# Altium schematic sheet RPE_Sch.SchDoc
size A4; SheetNumber: 1; SheetTotal: 2
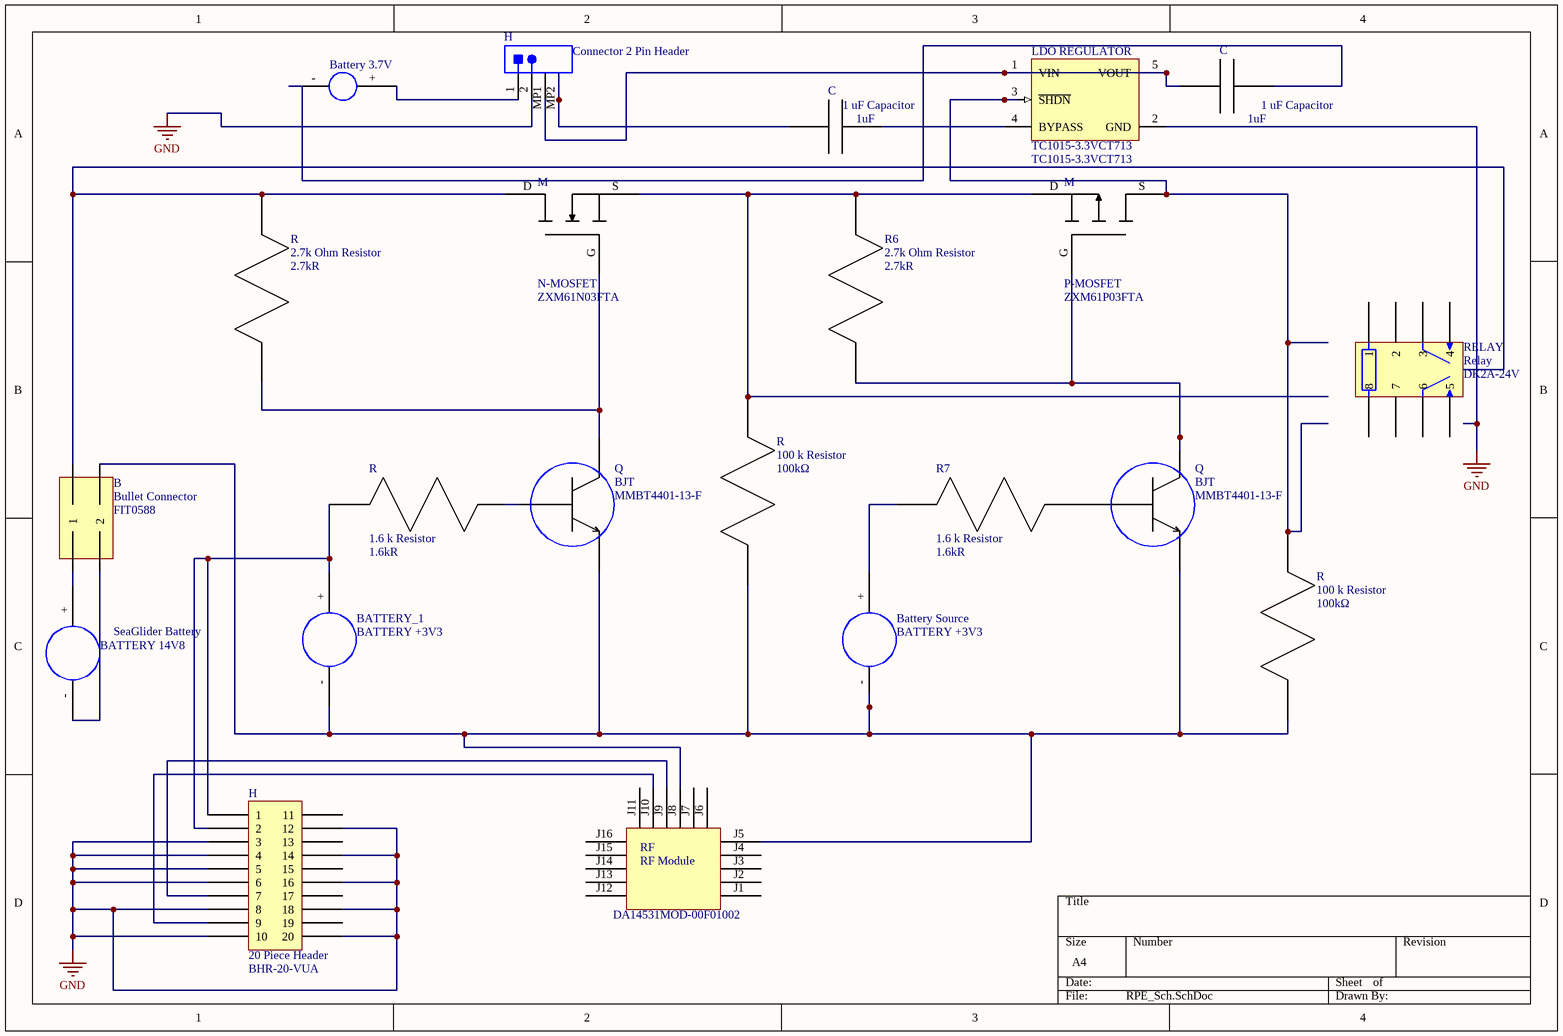
[diagram p0: RPE_Sch.SchDoc]

## Parts
(Parts that share a designator on the sheet are numbered #1, #2 ... from top to bottom, then left to right.)
B  Bullet Connector
BATTERY_1  BATTERY +3V3
Battery_3.7V  (no value)
Battery_Source  BATTERY +3V3
C#1  1 uF Capacitor  value 1uF
C#2  1 uF Capacitor  value 1uF
H#1  Connector 2 Pin Header
H#2  20 Piece Header
LDO_REGULATOR  TC1015-3.3VCT713
M#1  N-MOSFET
M#2  P-MOSFET
Q#1  BJT  Manufacturer Part Number: MMBT4401-13-F
Q#2  BJT  Manufacturer Part Number: MMBT4401-13-F
R6  2.7k Ohm Resistor  value 2.7kR
R7  1.6 k Resistor  value 1.6kR
R#1  2.7k Ohm Resistor  value 2.7kR
R#2  100 k Resistor  Resistance: 100kΩ
R#3  1.6 k Resistor  value 1.6kR
R#4  100 k Resistor  Resistance: 100kΩ
RELAY  Relay
RF  RF Module
SeaGlider_Battery  BATTERY 14V8

## Nets
GND: H#1.2 H#2.?2(12) H#2.?4(14) H#2.?6(16) H#2.?8(18) H#2.?10(20) H#2.?13(3) H#2.?14(4) H#2.?15(5) H#2.?16(6) H#2.?18(8) H#2.?20(10) LDO_REGULATOR.2(GND)
NetB_?1: B.?1 M#1.D R#1.?1
NetB_?2: B.?2 BATTERY_1.- Battery_Source.- Q#1.?2 Q#2.?2 R#2.?2 R#4.?2 RF.J5 RF.J8
NetB_?3: B.?3(2) SeaGlider_Battery.-
NetB_?4: B.?4(1) SeaGlider_Battery.+
NetBATTERY_1_+: BATTERY_1.+ H#2.?11(1) H#2.?12(2) R#3.?2
NetBattery_3.7V_+: Battery_3.7V.+ H#1.1
NetBattery_3.7V_-: Battery_3.7V.- C#1.?1
NetBattery_Source_+: Battery_Source.+ R7.?2
NetC#1_?2: C#1.?2 H#1.MP1 LDO_REGULATOR.1(VIN) LDO_REGULATOR.5(VOUT)
NetC#2_?1: C#2.?1 LDO_REGULATOR.4(BYPASS)
NetC#2_?2: C#2.?2 H#1.MP2
NetH#2_?17: H#2.?17(7) RF.J9
NetH#2_?19: H#2.?19(9) RF.J10
NetLDO_REGULATOR_3: LDO_REGULATOR.3(~{SHDN}) M#2.S R#4.?1
NetM#1_G: M#1.G Q#1.?1 R#1.?2
NetM#1_S: M#1.S M#2.D R6.?1 R#2.?1
NetM#2_G: M#2.G Q#2.?1 R6.?2
NetQ#1_?3: Q#1.?3 R#3.?1
NetQ#2_?3: Q#2.?3 R7.?1

Not connected (* = marked no-connect by the designer): H#2 ?1(11) ?3(13) ?5(15) ?7(17) ?9(19); RELAY ?1(5) ?2(3) ?3(2) ?4(1) ?5(6) ?6(4) ?7(7) ?8(8); RF J1 J2 J3 J4 J6 J7 J11 J12 J13 J14 J15 J16

## Library data of the parts
B = FIT0588: High Quality Gold Plated Male and Female Bullet Connector; Manufacturer: DFRobot; Supplier: Digi-Key; Supplier Part Number: 1738-1438-ND; RoHS: No; Category: Uncategorized; Stock: 164; Pricing: 1=3.9 (USD); ComponentLink1URL: https://media.digikey.com/pdf/Data%20Sheets/DFRobot%20PDFs/FIT0588_Web.pdf?src-supplier=Digi-Key; ComponentLink1Description: https://media.digikey.com/pdf/Data%20Sheets/DFRobot%20PDFs/FIT0588_Web.pdf?src-supplier=Digi-Key; Manufacturer Part Number: FIT0588
BATTERY_1 Battery_3.7V Battery_Source SeaGlider_Battery = BR-100346 Battery
C#1 C#2 = CL10B105MO8NNWC: SMD Multilayer Ceramic Capacitor, 1 µF, 16 V, 0603 [1608 Metric], ± 20%, X7R, CL Series; Manufacturer: Samsung; Voltage Rating: 16V; Dielectric: 1511DielectricType; Supplier: Digi-Key; Supplier Part Number: 1276-6524-1-ND; Manufacturer Part Number: CL10B105MO8NNWC; RoHS: Yes; Category: Ceramic Capacitors; Stock: 1597349; Pricing: 1=0.1, 10=0.034, 50=0.0196, 100=0.0152, 500=0.01142, 1000=0.00897 (USD); Mounting Technology: Surface Mount; Case/Package: 0603; Case Code (Metric): 1608; Case Code (Imperial): 0603; Material: 4241ConductorMaterial; Min Operating Temperature: -55°C; Max Operating Temperature: 125°C; Packaging: Cut Tape; Tolerance: 20%; Series: CL; Voltage Rating (DC): 16V; Length: 0.063inch; Width: 0.031inch; Height: 900um; Thickness: 0.035inch; RoHS Compliant: Yes; ComponentLink1URL: https://media.digikey.com/pdf/Data%20Sheets/Samsung%20PDFs/CL10B105MO8NNWC.pdf?src-supplier=Digi-Key; ComponentLink1Description: https://media.digikey.com/pdf/Data%20Sheets/Samsung%20PDFs/CL10B105MO8NNWC.pdf?src-supplier=Digi-Key; ComponentLink2URL: http://www.farnell.com/datasheets/2710574.pdf?src-supplier=Farnell; ComponentLink2Description: http://www.farnell.com/datasheets/2710574.pdf?src-supplier=Farnell; ComponentLink3URL: https://datasheet.octopart.com/CL10B105MO8NNWC-Samsung-Electro-Mechanics-datasheet-120079234.pdf?src-supplier=Future+Electronics; ComponentLink3Description: https://datasheet.octopart.com/CL10B105MO8NNWC-Samsung-Electro-Mechanics-datasheet-120079234.pdf?src-supplier=Future+Electronics; ComponentLink4URL: http://www.farnell.com/datasheets/2710574.pdf?src-supplier=Newark; ComponentLink4Description: http://www.farnell.com/datasheets/2710574.pdf?src-supplier=Newark; ComponentLink5URL: http://www.farnell.com/datasheets/2710574.pdf?src-supplier=Element14; ComponentLink5Description: http://www.farnell.com/datasheets/2710574.pdf?src-supplier=Element14
H#1 = CN-1P-2M-R2
H#2 = BHR-20-VUA: Conn Shrouded Header (4 Sides) HDR 20 POS 2.54mm Solder ST Top Entry Thru-Hole Tray; Manufacturer: Adam Equipment; Number of Positions: 20; Voltage Rating (AC): 250V; Current Rating: 1A; Supplier: Digi-Key; Supplier Part Number: 2057-BHR-20-VUA-ND; RoHS: Yes; Category: Card Edge Connectors; Stock: 4101; Pricing: 1=0.4, 10=0.339, 160=0.26356, 480=0.2259, 960=0.18824, 4960=0.16135, 10080=0.15059 (USD); Contact Material: Brass; Contact Shape: Square; Contact Finish - Mating: GOLD; Insulation Material: PBT; Contact Plating: Gold; Min Operating Temperature: -50°C; Max Operating Temperature: 105°C; Number of Rows: 2; Packaging: Tray; Termination: Solder; Series: BHR; Connector Type: Header; Fastening Type: Pull; Contact Type: Male Pin; Package Quantity: 216; Pitch: 2.54mm; Flammability Rating: UL94 V-0; Lead Free: Lead Free; ComponentLink1URL: https://datasheet.ciiva.com/16418/page-319-321-16418950.pdf?src-supplier=Future+Electronics; ComponentLink1Description: https://datasheet.ciiva.com/16418/page-319-321-16418950.pdf?src-supplier=Future+Electronics; Manufacturer Part Number: BHR-20-VUA
LDO_REGULATOR = TC1015-3.3VCT713: TC1015 Series 100 mA 3.3 V Fixed Output LDO Regulator w/ Shutdown - SOT-23-5; Manufacturer: Microchip; Min Input Voltage: 2.7V; Max Supply Voltage: 6V; Output Voltage: 3.3V; Number of Outputs: 1; Polarity: Positive; Accuracy: 2.5%; Max Output current: 100mA; Dropout Voltage: 180mV; Quiescent Current: 80uA; Power Supply Rejection Ratio (PSRR): 64dB; Number of Channels: 1NUMBER; Supplier: Digi-Key; Supplier Part Number: TC1015-3.3VCT713CT-ND; RoHS: Yes; Category: Voltage Regulators - Linear; Stock: 18340; Pricing: 1=0.49, 25=0.41, 100=0.36 (USD); Mounting Technology: Surface Mount; Case/Package: SOT-23; Pins: 5; Min Operating Temperature: -40°C; Max Operating Temperature: 125°C; Packaging: Tape and Reel; Output Type: Fixed; Series: -; Package Quantity: 3000; Output Current: 100mA; Number of Regulators: 1; Termination: SMD/SMT; Current Rating: 100mA; Min Supply Voltage: 2.7V; Nominal Output Voltage: 3.3V; Min Output Voltage: 3.3V; Max Output Voltage: 3.3V; Output Configuration: Positive; Length: 3.1mm; Width: 1.8mm; Height: 1.3mm; Radiation Hardening: No; RoHS Compliant: Yes; Reach SVHC Compliant: No; Lead Free: Lead Free; ComponentLink1URL: https://datasheet.ciiva.com/41463/001085540-da-01-en-ic-reg-ldo-tc1015-3-3vct713-sot-23-5-mcp-41463228.pdf?src-supplier=Conrad; ComponentLink1Description: https://datasheet.ciiva.com/41463/001085540-da-01-en-ic-reg-ldo-tc1015-3-3vct713-sot-23-5-mcp-41463228.pdf?src-supplier=Conrad; ComponentLink2URL: https://datasheet.ciiva.com/8238/jp011417-8238485.pdf?src-supplier=Avnet; ComponentLink2Description: https://datasheet.ciiva.com/8238/jp011417-8238485.pdf?src-supplier=Avnet; ComponentLink3URL: https://datasheet.ciiva.com/2040/filehandler-aspxddocname-en026002-2040022.pdf?src-supplier=Digi-Key; ComponentLink3Description: https://datasheet.ciiva.com/2040/filehandler-aspxddocname-en026002-2040022.pdf?src-supplier=Digi-Key; ComponentLink4URL: https://datasheet.ciiva.com/2040/filehandler-aspxddocname-en026002-2040023.pdf?src-supplier=Digi-Key; ComponentLink4Description: https://datasheet.ciiva.com/2040/filehandler-aspxddocname-en026002-2040023.pdf?src-supplier=Digi-Key; ComponentLink5URL: https://datasheet.ciiva.com/2040/filehandler-aspxddocname-en026002-2040024.pdf?src-supplier=Digi-Key; ComponentLink5Description: https://datasheet.ciiva.com/2040/filehandler-aspxddocname-en026002-2040024.pdf?src-supplier=Digi-Key; ComponentLink6URL: https://datasheet.ciiva.com/2075/21335e-2075754.pdf?src-supplier=Digi-Key; ComponentLink6Description: https://datasheet.ciiva.com/2075/21335e-2075754.pdf?src-supplier=Digi-Key; ComponentLink7URL: https://datasheet.ciiva.com/14562/70046349-14562758.pdf?src-supplier=Allied+Electronics; ComponentLink7Description: https://datasheet.ciiva.com/14562/70046349-14562758.pdf?src-supplier=Allied+Electronics; ComponentLink8URL: https://datasheet.ciiva.com/22711/82112-22711035.pdf?src-supplier=Element14; ComponentLink8Description: https://datasheet.ciiva.com/22711/82112-22711035.pdf?src-supplier=Element14; ComponentLink9URL: https://datasheet.ciiva.com/8041/21335e-8041544.pdf?src-supplier=Element14; ComponentLink9Description: https://datasheet.ciiva.com/8041/21335e-8041544.pdf?src-supplier=Element14; Manufacturer Part Number: TC1015-3.3VCT713
M#1 = ZXM61N03FTA: N-Channel 30V 1.4A (Ta) 625mW (Ta) Surface Mount SOT-23-3; Manufacturer: Diodes Zetex; Rise Time: 2.5ns; Gate to Source Voltage (Vgs): 20V; Turn-Off Delay Time: 5.8ns; Turn-On Delay Time: 1.9ns; Rds On Max: 220mR; Input Capacitance: 150pF; Nominal Vgs: 1V; Number of Elements: 1; Power Dissipation: 806mW; Current Rating: 1.2A; Supplier: Digi-Key; Supplier Part Number: ZXM61N03FCT-ND; RoHS: Yes; Category: MOSFETs; Stock: 141855; Pricing: 1=0.46, 10=0.397, 100=0.2757, 500=0.21528, 1000=0.17498 (USD); Mounting Technology: Surface Mount; Case/Package: SOT-23; Pins: 3; Weight: 0.000282oz; Min Operating Temperature: -55°C; Max Operating Temperature: 150°C; Fall Time: 2.5ns; Package Quantity: 3000; Packaging: Tape and Reel; Max Power Dissipation: 625mW; Dual Supply Voltage: 30V; Drain to Source Voltage (Vdss): 30V; Continuous Drain Current (ID): 1.4A; Number of Channels: 1; Drain to Source Resistance: 220mR; Termination: SMD/SMT; Voltage Rating (DC): 30V; Polarity: N-CHANNEL; Series: -; Drain-source On Resistance-Max: 220mR; Length: 3.04mm; Width: 1.4mm; Height: 1.02mm; Radiation Hardening: No; Reach SVHC Compliant: No; Lead Free: Lead Free; RoHS Compliant: Yes; ComponentLink1URL: https://datasheet.ciiva.com/11176/zxm61n03f-11176547.pdf?src-supplier=Avnet; ComponentLink1Description: https://datasheet.ciiva.com/11176/zxm61n03f-11176547.pdf?src-supplier=Avnet; ComponentLink2URL: https://datasheet.ciiva.com/935/zxm61n03f-935122.pdf?src-supplier=Digi-Key; ComponentLink2Description: https://datasheet.ciiva.com/935/zxm61n03f-935122.pdf?src-supplier=Digi-Key; ComponentLink3URL: https://datasheet.ciiva.com/5775/1643170-5775147.pdf?src-supplier=Farnell; ComponentLink3Description: https://datasheet.ciiva.com/5775/1643170-5775147.pdf?src-supplier=Farnell; ComponentLink4URL: https://datasheet.ciiva.com/935/zxm61n03f-935123.pdf?src-supplier=Digi-Key; ComponentLink4Description: https://datasheet.ciiva.com/935/zxm61n03f-935123.pdf?src-supplier=Digi-Key; ComponentLink5URL: https://datasheet.ciiva.com/935/zxm61n03f-935124.pdf?src-supplier=Digi-Key; ComponentLink5Description: https://datasheet.ciiva.com/935/zxm61n03f-935124.pdf?src-supplier=Digi-Key; ComponentLink6URL: https://datasheet.ciiva.com/8024/1643170-8024088.pdf?src-supplier=Element14; ComponentLink6Description: https://datasheet.ciiva.com/8024/1643170-8024088.pdf?src-supplier=Element14; Manufacturer Part Number: ZXM61N03FTA
M#2 = ZXM61P03FTA: ZXM61P03F 30 V 0.35 Ohm P-Channel Enhancement Mode Vertical DMOS FET - SOT-23; Manufacturer: Diodes Zetex; Rise Time: 2.9ns; Gate to Source Voltage (Vgs): 20V; Turn-Off Delay Time: 8.9ns; Turn-On Delay Time: 1.9ns; Nominal Vgs: -1V; Max Power Dissipation: 625mW; Rds On Max: 350mR; Input Capacitance: 140pF; Number of Elements: 1; Dual Supply Voltage: -30V; Drain to Source Voltage (Vdss): 30V; Continuous Drain Current (ID): 1.1A; Drain to Source Resistance: 550mR; Power Dissipation: 806mW; Current Rating: -1.1A; Supplier: Digi-Key; Supplier Part Number: ZXM61P03FCT-ND; RoHS: Yes; Category: MOSFETs; Stock: 114739; Pricing: 1=0.42, 10=0.357, 100=0.2482, 500=0.19376, 1000=0.15748 (USD); Mounting Technology: Surface Mount; Case/Package: SOT-23; Pins: 3; Weight: 0.000282oz; Min Operating Temperature: -55°C; Max Operating Temperature: 150°C; Fall Time: 2.9ns; Packaging: Tape and Reel; Package Quantity: 3000; Number of Channels: 1; Termination: SMD/SMT; Voltage Rating (DC): -30V; Polarity: P-CHANNEL; Series: -; Drain-source On Resistance-Max: 350mR; Length: 3.04mm; Width: 1.4mm; Height: 1.02mm; Radiation Hardening: No; Reach SVHC Compliant: No; Lead Free: Lead Free; RoHS Compliant: Yes; ComponentLink1URL: https://datasheet.ciiva.com/11176/zxm61p03f-11176401.pdf?src-supplier=Avnet; ComponentLink1Description: https://datasheet.ciiva.com/11176/zxm61p03f-11176401.pdf?src-supplier=Avnet; ComponentLink2URL: https://datasheet.ciiva.com/11176/zxm61p03f-11176557.pdf?src-supplier=Avnet; ComponentLink2Description: https://datasheet.ciiva.com/11176/zxm61p03f-11176557.pdf?src-supplier=Avnet; ComponentLink3URL: https://datasheet.ciiva.com/935/zxm61p03f-935140.pdf?src-supplier=Digi-Key; ComponentLink3Description: https://datasheet.ciiva.com/935/zxm61p03f-935140.pdf?src-supplier=Digi-Key; ComponentLink4URL: https://datasheet.ciiva.com/935/zxm61p03f-935141.pdf?src-supplier=Digi-Key; ComponentLink4Description: https://datasheet.ciiva.com/935/zxm61p03f-935141.pdf?src-supplier=Digi-Key; ComponentLink5URL: https://datasheet.ciiva.com/935/zxm61p03f-935142.pdf?src-supplier=Digi-Key; ComponentLink5Description: https://datasheet.ciiva.com/935/zxm61p03f-935142.pdf?src-supplier=Digi-Key; ComponentLink6URL: https://datasheet.ciiva.com/4443/zxm61p03f-4443147.pdf?src-supplier=Mouser; ComponentLink6Description: https://datasheet.ciiva.com/4443/zxm61p03f-4443147.pdf?src-supplier=Mouser; ComponentLink7URL: https://datasheet.ciiva.com/16216/zxm61p03f-16216056.pdf?src-supplier=Future+Electronics; ComponentLink7Description: https://datasheet.ciiva.com/16216/zxm61p03f-16216056.pdf?src-supplier=Future+Electronics; Manufacturer Part Number: ZXM61P03FTA
Q#1 Q#2 = MMBT4401-13-F (2): Bipolar Transistors - 40V NPN SMALL SIGNAL TRANSISTOR IN SOT23 package; Manufacturer: Diodes Zetex; Max Power Dissipation: 310mW; Frequency: 250MHz; Max Collector Current: 600mA; Collector Base Voltage (VCBO): 60V; Number of Elements: 1; Emitter Base Voltage (VEBO): 6V; Collector-emitter Voltage-Max: 750mV; RoHS: Yes; Category: BJTs; Stock: 197669; Pricing: 1=0.14, 10=0.082, 50=0.082, 100=0.042, 1000=0.023, 10000=0.014 (USD); Mounting Technology: Surface Mount; Case/Package: SOT-23; Pins: 3; Min Operating Temperature: -55°C; Max Operating Temperature: 150°C; Packaging: Tape and Reel; Collector Emitter Voltage (VCEO): 40V; Transition Frequency: 250MHz; Polarity: NPN; Power Dissipation: 310mW; Collector Emitter Breakdown Voltage: 40V; Series: Automotive, AEC-Q101; Clock Frequency: 250MHz; Radiation Hardening: No; Reach SVHC Compliant: No; RoHS Compliant: Yes; ComponentLink1URL: https://datasheet.ciiva.com/15139/getdatasheetpartid-234007-15139792.pdf?src-supplier=Verical; ComponentLink1Description: https://datasheet.ciiva.com/15139/getdatasheetpartid-234007-15139792.pdf?src-supplier=Verical; Supplier: Mouser; Supplier Part Number: 1-MMBT4401-13-F
R6 R#1 = CR0603-FX-2701ELF: SMD Chip Resistor, 2.7 kOhm, ± 1%, 100 mW, 0603 [1608 Metric], Thick Film, General Purpose; Manufacturer: Bourns; Power Rating: 100mW; Voltage Rating: 50V; Temperature Coefficient: 100ppm/°C; Supplier: Digi-Key; Supplier Part Number: CR0603-FX-2701ELFDKR-ND; Manufacturer Part Number: CR0603-FX-2701ELF; RoHS: Yes; Category: Chip SMD Resistors; Stock: 119692; Pricing: 1=0.1, 10=0.015, 50=0.009, 100=0.0075, 500=0.00498, 1000=0.00425 (USD); Mounting Technology: Surface Mount; Case/Package: 0603; Case Code (Imperial): 0603; Case Code (Metric): 1608; Contact Plating: Tin; Min Operating Temperature: -55°C; Max Operating Temperature: 155°C; Tolerance: 1%; Packaging: Tape and Reel; Package Quantity: 5000; Termination: SMD/SMT; Number of Terminations: 2; Max Power Dissipation: 100mW; Features: Moisture Resistant; Series: CR0603; Voltage Rating (DC): 50V; Length: 0.063inch; Width: 0.031inch; Height: 0.022inch; Thickness: 457um; Radiation Hardening: No; RoHS Compliant: Yes; ComponentLink1URL: https://datasheet.ciiva.com/18607/chpreztr-18607957.pdf?src-supplier=Digi-Key; ComponentLink1Description: https://datasheet.ciiva.com/18607/chpreztr-18607957.pdf?src-supplier=Digi-Key
R7 R#3 = SG73P1JTTD1601F: Res, 1K6, 1%, 0.2W, 0603 Rohs Compliant: Yes; Manufacturer: KOA Speer; Power Rating: 200mW; Voltage Rating: 50V; Temperature Coefficient: 100ppm/°C; Supplier: Digi-Key; Supplier Part Number: 2019-SG73P1JTTD1601FTR-ND; Manufacturer Part Number: SG73P1JTTD1601F; RoHS: Yes; Category: Chip SMD Resistors; Stock: 5000; Pricing: 5000=0.01791 (USD); Case/Package: 0603; Pins: 2; Case Code (Imperial): 0603; Case Code (Metric): 1608; Min Operating Temperature: -55°C; Max Operating Temperature: 155°C; Packaging: Tape and Reel; Package Quantity: 5000; Tolerance: 1%; Voltage Rating (DC): 50V; Resistor Type: Thick Film; Termination: SMD/SMT; Series: SG73; Resistance Tolerance: 1%; Length: 1.6mm; Width: 0.8mm; Height: 0.45mm; RoHS Compliant: Yes; Reach SVHC Compliant: Unknown; ComponentLink1URL: https://datasheet.ciiva.com/22640/78338-22640856.pdf?src-supplier=Farnell; ComponentLink1Description: https://datasheet.ciiva.com/22640/78338-22640856.pdf?src-supplier=Farnell
R#2 R#4 = CR0603FB100KS1 Chip Resistor: CR0603FB100KS1 Chip Resistor, 100kΩ
RELAY = DK2A-24V: Electromechanical Relay 24VDC 2.88KOhm 8A DPST-NO (20x15x10)mm THT Power Relay; Manufacturer: Panasonic; Voltage Rating (AC): 250V; Voltage Rating (DC): 125V; Power Rating: 200mW; Throw Configuration: DPST; Coil Resistance: 2.88kR; Coil Current: 8.3mA; Operate Time: 10ms; Release Time: 8ms; Coil Voltage (DC): 24V; Coil Type: Non-Latching; Relay Type: General Purpose; Supplier: Digi-Key; Supplier Part Number: 255-1600-ND; RoHS: Yes; Category: Signal Relays; Stock: 5246; Pricing: 1=11.08, 10=10.385, 25=9.2312, 50=8.7698, 100=8.3083, 250=7.38512, 500=6.92356, 1000=6.46198 (USD); Mounting Technology: Through Hole; Case/Package: DIP; Pins: 6; Contact Material: Silver,Tin,Gold; Weight: 6g; Min Operating Temperature: -40°C; Max Operating Temperature: 65°C; Packaging: Bulk; Max Current Rating: 8A; Package Quantity: 50; Current Rating: 8A; Termination: PC Pin; Series: DK; Contact Current Rating: 8A; Max Voltage Rating (AC): 250V; Max Voltage Rating (DC): 125V; Power Consumption: 200mW; Switching Current: 8A; Length: 20mm; Width: 15mm; Height: 9.7mm; Depth: 15mm; Radiation Hardening: No; Reach SVHC Compliant: No; Lead Free: Lead Free; RoHS Compliant: Yes; ComponentLink1URL: https://datasheet.ciiva.com/15185/getdatasheetpartid-292134-15185987.pdf?src-supplier=Verical; ComponentLink1Description: https://datasheet.ciiva.com/15185/getdatasheetpartid-292134-15185987.pdf?src-supplier=Verical; ComponentLink2URL: https://datasheet.ciiva.com/8000/51890-8000064.pdf?src-supplier=Element14; ComponentLink2Description: https://datasheet.ciiva.com/8000/51890-8000064.pdf?src-supplier=Element14; ComponentLink3URL: https://datasheet.ciiva.com/5736/51890-5736315.pdf?src-supplier=Farnell; ComponentLink3Description: https://datasheet.ciiva.com/5736/51890-5736315.pdf?src-supplier=Farnell; ComponentLink4URL: https://datasheet.ciiva.com/26303/ds-61a03-en-dk-26303431.pdf?src-supplier=Distrelec; ComponentLink4Description: https://datasheet.ciiva.com/26303/ds-61a03-en-dk-26303431.pdf?src-supplier=Distrelec; ComponentLink5URL: https://datasheet.ciiva.com/7999/1537831-7999913.pdf?src-supplier=Element14; ComponentLink5Description: https://datasheet.ciiva.com/7999/1537831-7999913.pdf?src-supplier=Element14; Manufacturer Part Number: DK2A-24V
RF = DA14531MOD-00F01002: Bluetooth Low Energy 5.1 Module Rohs Compliant: Yes; Manufacturer: Dialog Semiconductor; Supplier: Digi-Key; Supplier Part Number: 1695-DA14531MOD-00F01002CT-ND; RoHS: Yes; Category: RF Receivers, Transceivers; Stock: 232067; Pricing: 1=5.66, 10=5.05, 25=4.5448, 100=4.141, 250=3.737, 500=3.3532 (USD); ComponentLink1URL: https://www.dialog-semiconductor.com/da14531-module-datasheet?src-supplier=Digi-Key; ComponentLink1Description: https://www.dialog-semiconductor.com/da14531-module-datasheet?src-supplier=Digi-Key; Manufacturer Part Number: DA14531MOD-00F01002